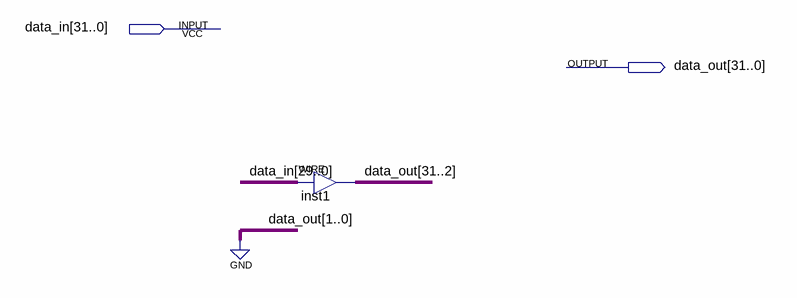
[diagram p0: schematic sheet]
// Quartus schematic shift2.bdf as structural Verilog: 1 symbols, 2 pins
module shift2 (
  input  [31:0] data_in,
  output [31:0] data_out
);

  assign data_out[31:2] = data_in[29:0];  // WIRE inst1

  assign data_out[1:0] = 2'b00;
endmodule
